# Altium project segway.PrjPcb
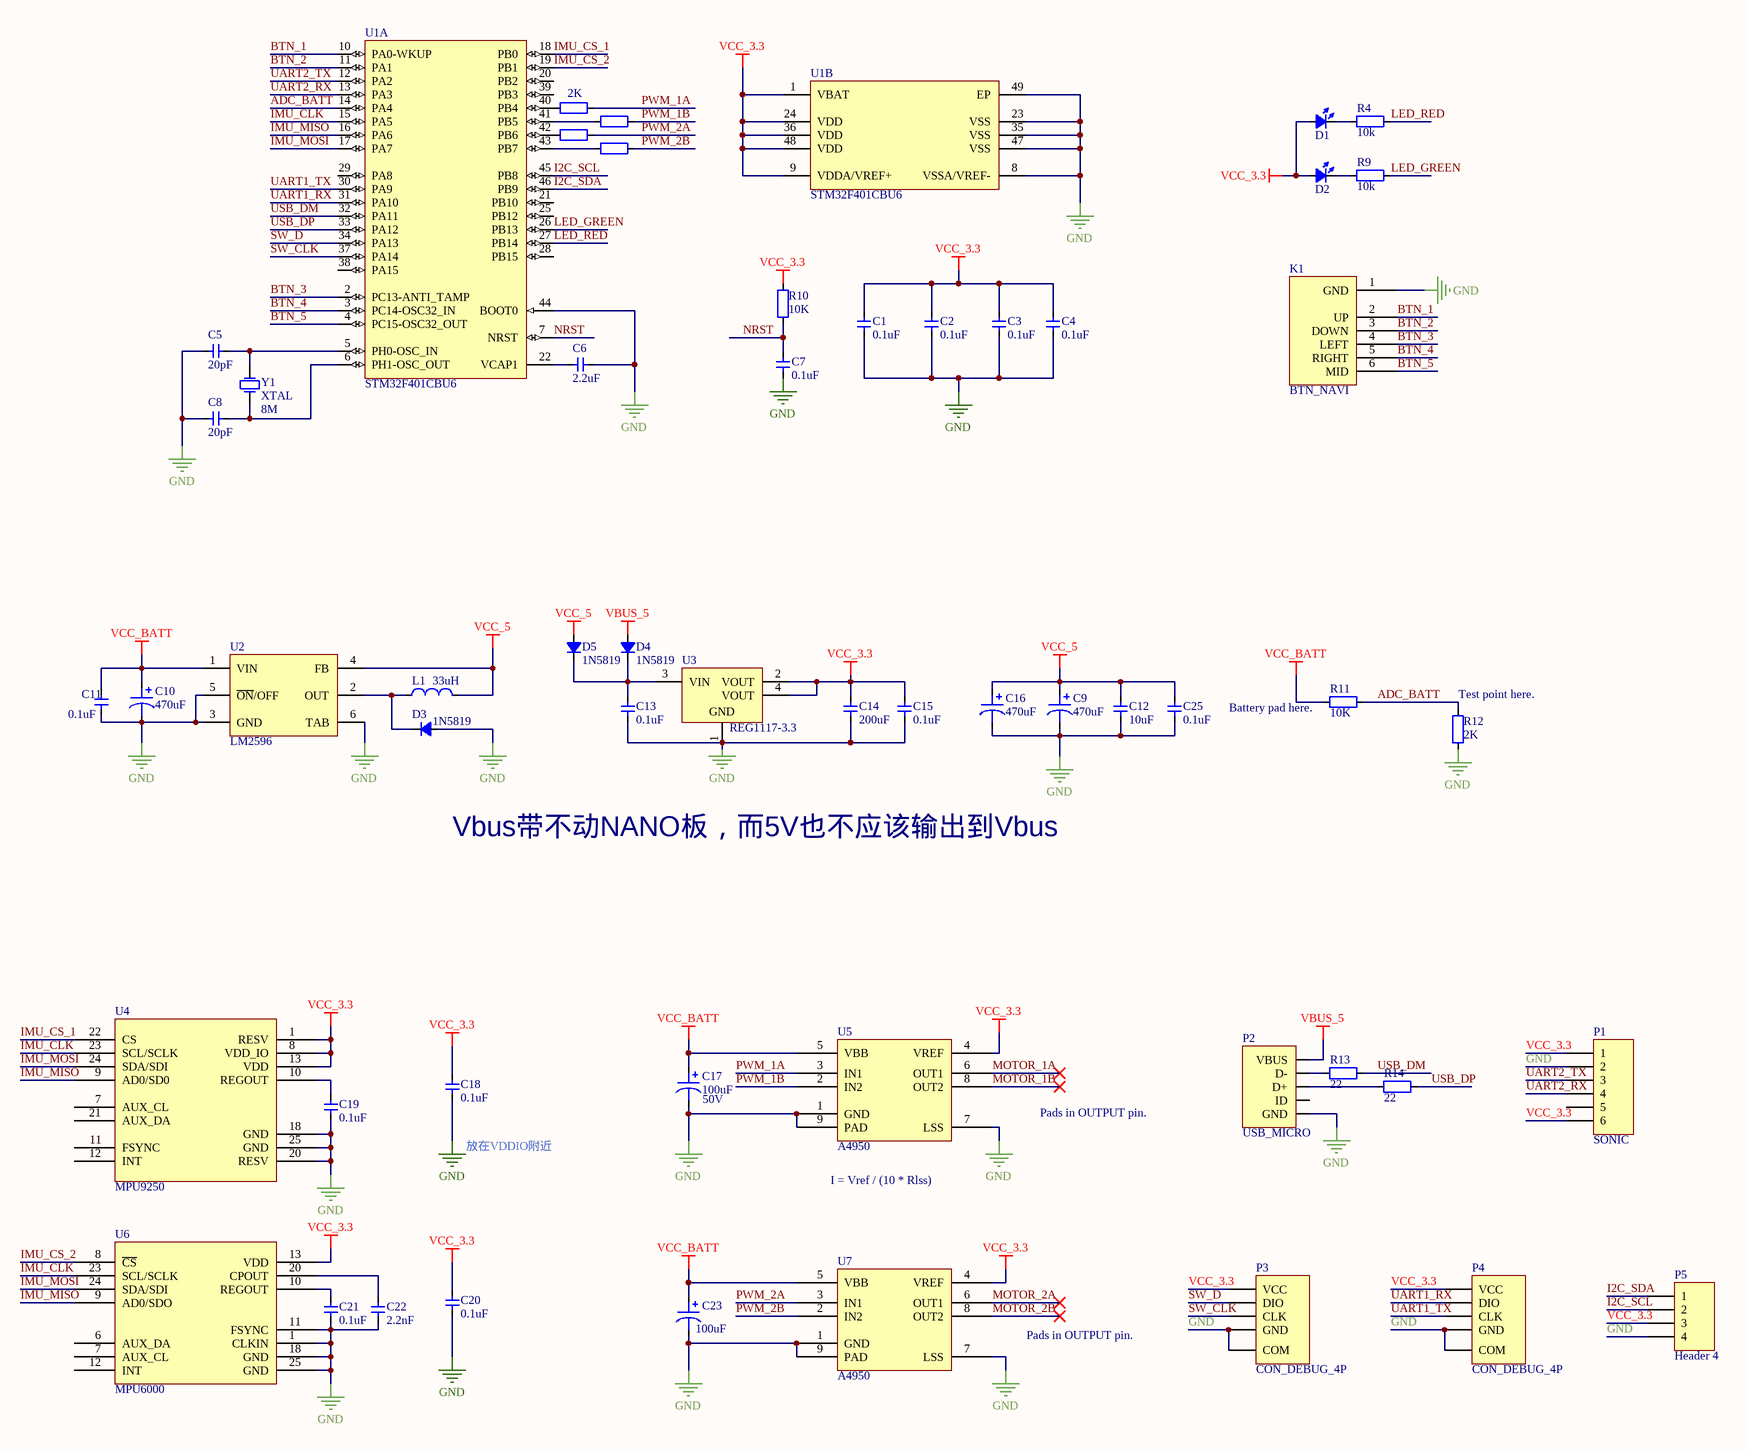
[diagram p0: sch_main.SchDoc]
1 sheet, 55 parts. Net scope: global (net labels, ports and power ports of the same name join across sheets).
Board file: pcb.PcbDoc

## Sheet sch_main.SchDoc
size A2

### Parts
C1  value 0.1uF  [CAP_0603]  (hidden comment: CAP)
C2  value 0.1uF  [CAP_0603]  (hidden comment: CAP)
C3  value 0.1uF  [CAP_0603]  (hidden comment: CAP)
C4  value 0.1uF  [CAP_0603]  (hidden comment: CAP)
C5  value 20pF  [CAP_0603]  (hidden comment: CAP)
C6  value 2.2uF  [CAP_0603]  (hidden comment: CAP)
C7  value 0.1uF  [CAP_0603]  (hidden comment: CAP)
C8  value 20pF  [CAP_0603]  (hidden comment: CAP)
C9  470uF  [CAP ALUM 6.6MM]
C10  470uF  [CAP ALUM 6.6MM]
C11  value 0.1uF  [CAP_0805]  (hidden comment: CAP)
C12  value 10uF  [CAP_TAN_B1210]  (hidden comment: CAP)
C13  value 0.1uF  [CAP_0805]  (hidden comment: CAP)
C14  value 200uF  [CAP_0805]  (hidden comment: CAP)
C15  value 0.1uF  [CAP_0603]  (hidden comment: CAP)
C16  470uF  [CAP ALUM 6.6MM]
C17  100uF  Voltage: 50V  [CAP ALUM 6.6MM]
C18  value 0.1uF  [CAP_0603]  (hidden comment: CAP)
C19  value 0.1uF  [CAP_0603]  (hidden comment: CAP)
C20  value 0.1uF  [CAP_0603]  (hidden comment: CAP)
C21  value 0.1uF  [CAP_0603]  (hidden comment: CAP)
C22  value 2.2nF  [CAP_0603]  (hidden comment: CAP)
C23  100uF  [CAP ALUM 6.6MM]
C25  value 0.1uF  [CAP_0603]  (hidden comment: CAP)
D1  LED  [LED_0603_GREEN]  (value not drawn)
D2  LED  [LED_0603_GREEN]  (value not drawn)
D3  value 1N5819  [DIO_SOD-123]  (hidden comment: Diode)
D4  value 1N5819  [DIO_SOD-123]  (hidden comment: Diode)
D5  value 1N5819  [DIO_SOD-123]  (hidden comment: Diode)
K1  BTN_NAVI  [BTN_NAVI_10x10]
L1  value 33uH  [IND_CDRH74]  (hidden comment: IND)
P1  SONIC  [HDR1X6]
P2  USB_MICRO  [USB_MICRO]
P3  CON_DEBUG_4P  [CON_DEBUG_4P_STD]
P4  CON_DEBUG_4P  [CON_DEBUG_4P_STD]
P5  Header 4  [HDR1X4]
R1  value 2K  [RES_0603]  (hidden comment: RES)
R3  RES  [RES_0603]  (value not drawn)
R4  value 10k  [RES_0603]  (hidden comment: RES)
R6  RES  [RES_0603]  (value not drawn)
R8  RES  [RES_0603]  (value not drawn)
R9  value 10k  [RES_0603]  (hidden comment: RES)
R10  value 10K  [RES_0603]  (hidden comment: RES)
R11  value 10K  [RES_0603]  (hidden comment: RES)
R12  value 2K  [RES_0603]  (hidden comment: RES)
R13  value 22  [RES_0603]  (hidden comment: RES)
R14  value 22  [RES_0603]  (hidden comment: RES)
U1  STM32F401CBU6  [STM-UFQFPN48_N]  (parts A,B of 2)
U2  LM2596  [LM2596]
U3  REG1117-3.3  [TI-DCY4_N]
U4  MPU9250  [MPU9250]
U5  A4950  [A4950]
U6  MPU6000  [MPU6000]
U7  A4950  [A4950]
Y1  XTAL  Frequency: 8M  [XTAL_8M]

### Nets
GND: C1.1 C2.1 C3.1 C4.1 C5.1 C6.2 C7.1 C8.1 C9.2 C10.2 C11.1 C12.1 C13.1 C14.1 C15.1 C16.2 C17.2 C18.1 C19.1 C20.1 C21.1 C22.1 C23.2 C25.1 D3.1(A) K1.1(GND) P1.2 P2.5(GND) P3.4(GND) P3.5(COM) P4.4(GND) P4.5(COM) P5.4 R12.2 U1.8(VSSA/VREF-) U1.23(VSS) U1.35(VSS) U1.44(BOOT0) U1.47(VSS) U1.49(EP) U2.3(GND) U2.5(~{ON}/OFF) U2.6(TAB) U3.1(GND) U4.18(GND) U4.20(RESV) U4.25(GND) U5.1(GND) U5.7(LSS) U5.9(PAD) U6.1(CLKIN) U6.11(FSYNC) U6.18(GND) U6.25(GND) U7.1(GND) U7.7(LSS) U7.9(PAD)
VBUS_5: D4.1(A) P2.1(VBUS)
VCC_3.3: C1.2 C2.2 C3.2 C4.2 C14.2 C15.2 C18.2 C20.2 D1.1(A) D2.1(A) P1.1 P1.6 P3.1(VCC) P4.1(VCC) P5.3 R10.2 U1.1(VBAT) U1.9(VDDA/VREF+) U1.24(VDD) U1.36(VDD) U1.48(VDD) U3.2(VOUT) U3.4(VOUT) U4.1(RESV) U4.8(VDD_IO) U4.13(VDD) U5.4(VREF) U6.13(VDD) U7.4(VREF)
VCC_5: C9.1 C12.2 C16.1 C25.2 D5.1(A) L1.2 U2.4(FB)
VCC_BATT: C10.1 C11.2 C17.1 C23.1 R11.1 U2.1(VIN) U5.5(VBB) U7.5(VBB)
ADC_BATT: R11.2 R12.1 U1.14(PA4)
BTN_1: K1.2(UP) U1.10(PA0-WKUP)
BTN_2: K1.3(DOWN) U1.11(PA1)
BTN_3: K1.4(LEFT) U1.2(PC13-ANTI_TAMP)
BTN_4: K1.5(RIGHT) U1.3(PC14-OSC32_IN)
BTN_5: K1.6(MID) U1.4(PC15-OSC32_OUT)
I2C_SCL: P5.2 U1.45(PB8)
I2C_SDA: P5.1 U1.46(PB9)
IMU_CLK: U1.15(PA5) U4.23(SCL/SCLK) U6.23(SCL/SCLK)
IMU_CS_1: U1.18(PB0) U4.22(CS)
IMU_CS_2: U1.19(PB1) U6.8(~{CS})
IMU_MISO: U1.16(PA6) U4.9(AD0/SD0) U6.9(AD0/SDO)
IMU_MOSI: U1.17(PA7) U4.24(SDA/SDI) U6.24(SDA/SDI)
LED_GREEN: R9.1 U1.26(PB13)
LED_RED: R4.1 U1.27(PB14)
MOTOR_1A: U5.6(OUT1)
MOTOR_1B: U5.8(OUT2)
MOTOR_2A: U7.6(OUT1)
MOTOR_2B: U7.8(OUT2)
NRST: C7.2 R10.1 U1.7(NRST)
PWM_1A: R1.2 U5.3(IN1)
PWM_1B: R3.2 U5.2(IN2)
PWM_2A: R6.2 U7.3(IN1)
PWM_2B: R8.2 U7.2(IN2)
SW_CLK: P3.3(CLK) U1.37(PA14)
SW_D: P3.2(DIO) U1.34(PA13)
UART1_RX: P4.2(DIO) U1.31(PA10)
UART1_TX: P4.3(CLK) U1.30(PA9)
UART2_RX: P1.4 U1.13(PA3)
UART2_TX: P1.3 U1.12(PA2)
USB_DM: R13.2 U1.32(PA11)
USB_DP: R14.2 U1.33(PA12)
NetC5_2: C5.2 U1.5(PH0-OSC_IN) Y1.2(OSC2)
NetC6_1: C6.1 U1.22(VCAP1)
NetC8_2: C8.2 U1.6(PH1-OSC_OUT) Y1.1(OSC1)
NetC13_2: C13.2 D4.2(K) D5.2(K) U3.3(VIN)
NetC19_2: C19.2 U4.10(REGOUT)
NetC21_2: C21.2 U6.10(REGOUT)
NetC22_2: C22.2 U6.20(CPOUT)
NetD1_2: D1.2(K) R4.2
NetD2_2: D2.2(K) R9.2
NetD3_2: D3.2(K) L1.1 U2.2(OUT)
NetP2_2: P2.2(D-) R13.1
NetP2_3: P2.3(D+) R14.1
NetR1_1: R1.1 U1.40(PB4)
NetR3_1: R3.1 U1.41(PB5)
NetR6_1: R6.1 U1.42(PB6)
NetR8_1: R8.1 U1.43(PB7)

Not connected (* = marked no-connect by the designer): P1 5; P2 4(ID); U1 20(PB2) 21(PB10) 25(PB12) 28(PB15) 29(PA8) 38(PA15) 39(PB3); U4 7(AUX_CL) 11(FSYNC) 12(INT) 21(AUX_DA); U6 6(AUX_DA) 7(AUX_CL) 12(INT)

### Notes on the sheet
- (near R11) Battery pad here.
- (near R12) Test point here.
- Vbus带不动NANO板，而5V也不应该输出到Vbus
- Pads in OUTPUT pin.
- (near C18) 放在VDDIO附近
- (near U5) I = Vref / (10 * Rlss)

### Library data of the parts
C1-C8 C11-C15 C18-C22 C25 = CAP: Capacity
C9 C10 C16 = CAP_POL: SMT Polarised Capacitor; Value: 10uF
C17 = CAP_POL: SMT Polarised Capacitor; Value: 100uF
C23 = CAP_POL: SMT Polarised Capacitor; Voltage: 50V; Value: 100uF
L1 = IND: Inductor
P1 = Header 6: Header, 6-Pin; LatestRevisionDate: 17-Jul-2002; LatestRevisionNote: Re-released for DXP Platform.; Publisher: Altium Limited
P5 = Header 4: Header, 4-Pin; LatestRevisionDate: 17-Jul-2002; LatestRevisionNote: Re-released for DXP Platform.; Publisher: Altium Limited
R1 R4 R9-R14 = RES: Resister
R3 R6 R8 = RES: Resister; Value: 2K
U1 = STM32F401CBU6: ARM Cortex-M4 32-bit MCU+FPU, 105 DMIPS, 128 kB Flash, 64 kB Internal RAM, 36 I/Os, 48-pin UFQFPN, -40 to 85 degC, Tray; Manufacturer: STMicroelectronics; FLASH Size (Prog) (kB): 128; I/Os (High Current): 36; Internal RAM Size (kB): 64; Operating Frequency(F) (Processor speed) (MHz): 84; Supply Voltage(Vcc) max (V): 3.6; Supply Voltage(Vcc) min (V): 1.8; DatasheetVersion: Rev. 1; PackageVersion: Rev. 1, 04/2013; PackageReference: UFQFPN48; PackageDescription: 48-Pin Ultra Thin Fine Pitch Quad Flat No-Lead, 7 x 7 x 0.6 mm Body, 0.5 mm Pitch, Exposed Pad; Supplier 1: Newark; Supplier Part Number 1: 19X6215; Supplier 2: Mouser; Supplier Part Number 2: 511-STM32F401CBU6; Core: ARM Cortex-M4; Packing: Tray; Mounting Technology: Surface Mount; PartNumber: STM32F401CBU6; ComponentLink1Description: Manufacturer URL; ComponentLink1URL: http://www.st.com/web/en/home.html; ComponentLink2Description: Datasheet; ComponentLink2URL: http://www.st.com/st-web-ui/static/active/en/resource/technical/document/data_brief/DM00071938.pdf; ComponentLink3Description: Package Specification; ComponentLink3URL: http://www.st.com/st-web-ui/static/active/en/resource/technical/document/data_brief/DM00071938.pdf
U2 = LM2596: Power
U3 = REG1117-3.3: Single Output LDO, 800 mA, Fixed 3.3 V Output, 3.8 to 15 V Input, with Internal Current Limiting, 4-pin SOT-223 (DCY), -40 to 125 degC, Green (RoHS & no Sb/Br); Manufacturer: Texas Instruments; Fixed Output Options(V): 5; Iout(Max)(A): 0.8; Iq(Typ)(mA): 4; Rating: Catalog; SubFamily: Single Channel LDO; Vdo(Typ)(mV): 1100; Vin(Max)(V): 15; Vin(Min)(V): 3.8; Vout Adj(Max)(V): 3.3; DatasheetVersion: SBVS001D; PackageVersion: 4202506/B; PackageReference: DCY4; PackageDescription: 4-Pin Plastic Small Outline, Body 3.5 x 6.5 mm, Pitch 2.3 mm; Supplier 1: Digi-Key; Supplier Part Number 1: REG1117-3.3-ND; Supplier 2: Farnell; Supplier Part Number 2: 1212355; Supplier 3: Farnell; Supplier Part Number 3: 2126471; Supplier 4: Newark; Supplier Part Number 4: 35C1963; Supplier 5: Mouser; Supplier Part Number 5: 595-REG1117-3.3; Eco-Plan: Green (RoHS & no Sb/Br); Vout Adj(Min)(V): 3.3; Mounting Technology: Surface Mount; Code_JEDEC: TO-261; PartNumber: REG1117-3.3; ComponentLink1Description: Manufacturer URL; ComponentLink1URL: http://www.ti.com/; ComponentLink2Description: Datasheet; ComponentLink2URL: http://www.ti.com/general/docs/lit/getliterature.tsp?genericPartNumber=REG1117-33&fileType=pdf; ComponentLink3Description: Package Specification; ComponentLink3URL: http://www.ti.com/litv/pdf/mpds094a
U4 = MPU9250: Sensor
U5 U7 = A4950: Dual N-MOS, 40V, 3.5A.
U6 = MPU6000: IMU 6axis, (左下方引脚全部悬空)